# Altium schematic sheet Termination3V3.SchDoc
size A4; CompanyName: Technische Hochschule Nürnberg Georg Simon Ohm; Address1: Fürther Straße 250; Address2: 90429 Nürnberg; Address3: GERMANY; CompanyName2: Institut ELSYS
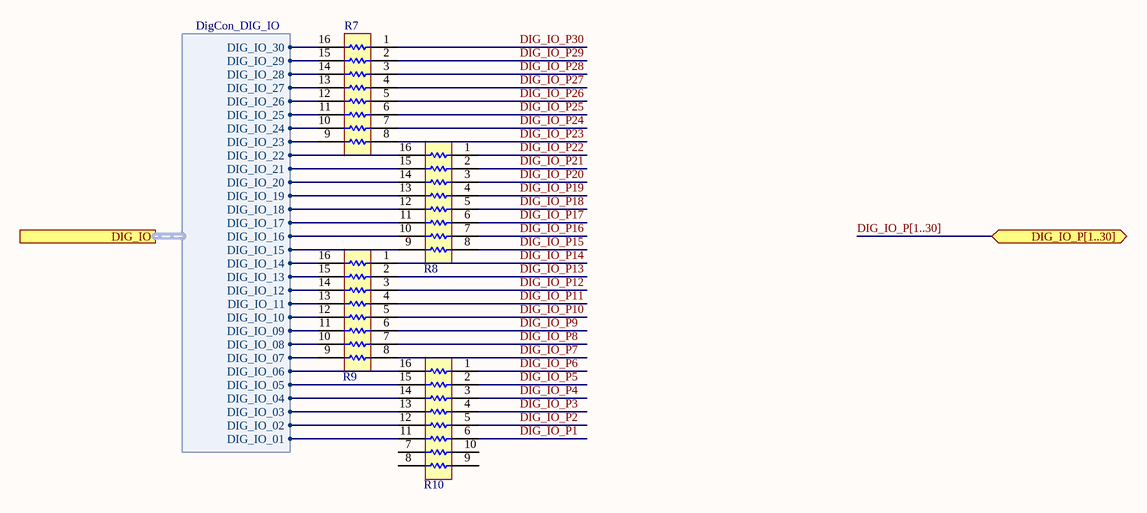
[diagram p0: Termination3V3.SchDoc]

## Parts
R7  0.063W  [RESCAXE-50P380X160X45-16N]  (value not drawn)
R8  0.063W  [RESCAXE-50P380X160X45-16N]  (value not drawn)
R9  0.063W  [RESCAXE-50P380X160X45-16N]  (value not drawn)
R10  0.063W  [RESCAXE-50P380X160X45-16N]  (value not drawn)

## Ports
DIG_IO (harness DigCon_DIG_IO), DIG_IO_P[1..30] (bidir)

## Harnesses
DigCon_DIG_IO: DIG_IO_01, DIG_IO_02, DIG_IO_03, DIG_IO_04, DIG_IO_05, DIG_IO_06, DIG_IO_07, DIG_IO_08, DIG_IO_09, DIG_IO_10, DIG_IO_11, DIG_IO_12, DIG_IO_13, DIG_IO_14, DIG_IO_15, DIG_IO_16, DIG_IO_17, DIG_IO_18, DIG_IO_19, DIG_IO_20, DIG_IO_21, DIG_IO_22, DIG_IO_23, DIG_IO_24, DIG_IO_25, DIG_IO_26, DIG_IO_27, DIG_IO_28, DIG_IO_29, DIG_IO_30

## Nets
DIG_IO_P1: R10.6
DIG_IO_P2: R10.5
DIG_IO_P3: R10.4
DIG_IO_P4: R10.3
DIG_IO_P5: R10.2
DIG_IO_P6: R10.1
DIG_IO_P7: R9.8
DIG_IO_P8: R9.7
DIG_IO_P9: R9.6
DIG_IO_P10: R9.5
DIG_IO_P11: R9.4
DIG_IO_P12: R9.3
DIG_IO_P13: R9.2
DIG_IO_P14: R9.1
DIG_IO_P15: R8.8
DIG_IO_P16: R8.7
DIG_IO_P17: R8.6
DIG_IO_P18: R8.5
DIG_IO_P19: R8.4
DIG_IO_P20: R8.3
DIG_IO_P21: R8.2
DIG_IO_P22: R8.1
DIG_IO_P23: R7.8
DIG_IO_P24: R7.7
DIG_IO_P25: R7.6
DIG_IO_P26: R7.5
DIG_IO_P27: R7.4
DIG_IO_P28: R7.3
DIG_IO_P29: R7.2
DIG_IO_P30: R7.1
NetR7_9: R7.9 ; port DIG_IO.DIG_IO_23
NetR7_10: R7.10 ; port DIG_IO.DIG_IO_24
NetR7_11: R7.11 ; port DIG_IO.DIG_IO_25
NetR7_12: R7.12 ; port DIG_IO.DIG_IO_26
NetR7_13: R7.13 ; port DIG_IO.DIG_IO_27
NetR7_14: R7.14 ; port DIG_IO.DIG_IO_28
NetR7_15: R7.15 ; port DIG_IO.DIG_IO_29
NetR7_16: R7.16 ; port DIG_IO.DIG_IO_30
NetR8_9: R8.9 ; port DIG_IO.DIG_IO_15
NetR8_10: R8.10 ; port DIG_IO.DIG_IO_16
NetR8_11: R8.11 ; port DIG_IO.DIG_IO_17
NetR8_12: R8.12 ; port DIG_IO.DIG_IO_18
NetR8_13: R8.13 ; port DIG_IO.DIG_IO_19
NetR8_14: R8.14 ; port DIG_IO.DIG_IO_20
NetR8_15: R8.15 ; port DIG_IO.DIG_IO_21
NetR8_16: R8.16 ; port DIG_IO.DIG_IO_22
NetR9_9: R9.9 ; port DIG_IO.DIG_IO_07
NetR9_10: R9.10 ; port DIG_IO.DIG_IO_08
NetR9_11: R9.11 ; port DIG_IO.DIG_IO_09
NetR9_12: R9.12 ; port DIG_IO.DIG_IO_10
NetR9_13: R9.13 ; port DIG_IO.DIG_IO_11
NetR9_14: R9.14 ; port DIG_IO.DIG_IO_12
NetR9_15: R9.15 ; port DIG_IO.DIG_IO_13
NetR9_16: R9.16 ; port DIG_IO.DIG_IO_14
NetR10_11: R10.11 ; port DIG_IO.DIG_IO_01
NetR10_12: R10.12 ; port DIG_IO.DIG_IO_02
NetR10_13: R10.13 ; port DIG_IO.DIG_IO_03
NetR10_14: R10.14 ; port DIG_IO.DIG_IO_04
NetR10_15: R10.15 ; port DIG_IO.DIG_IO_05
NetR10_16: R10.16 ; port DIG_IO.DIG_IO_06

Not connected (* = marked no-connect by the designer): R10 7 8 9 10

## Buses and harness runs
bus DIG_IO_P[1..30] = port DIG_IO_P[1..30]

## Notes on the sheet
- Title
- Size:
- Date:
- A4
- Revision:
- Time:
- Sheet
- of
- Author:
- Project:

## Library data of the parts
R7-R10 = 8xR-Array_1_part: Standard thick film resistor array with 8 resistors; Manufacturer1: Panasonic; MPN1: EXB2HV<2dig_res+#zeros><tol/jumper>V; Parameter1: V; Parameter1Desc: Package Method; Parameter2: J; Parameter2Desc: Tolerance Symbol; MaxVoltage: 100; Created: 2020-01-03_Thilo_Wendt; Supplier1: https://de.farnell.com/w/search?range=inc-in-stock&st=exb2hv; Package: RESCAXE-50P380X160X45-16N; HelpURL: https://www.mouser.de/datasheet/2/315/AOC0000C14-1108062.pdf; Parameter3: *; Parameter3Desc: *; ComponentLink1Description: Datasheet; ComponentLink1URL: https://www.mouser.de/datasheet/2/315/AOC0000C14-1108062.pdf; ComponentLink2Description: Landpattern; ComponentLink2URL: https://industrial.panasonic.com/cdbs/www-data/pdf/AOC0000/AOC0000COL4.pdf